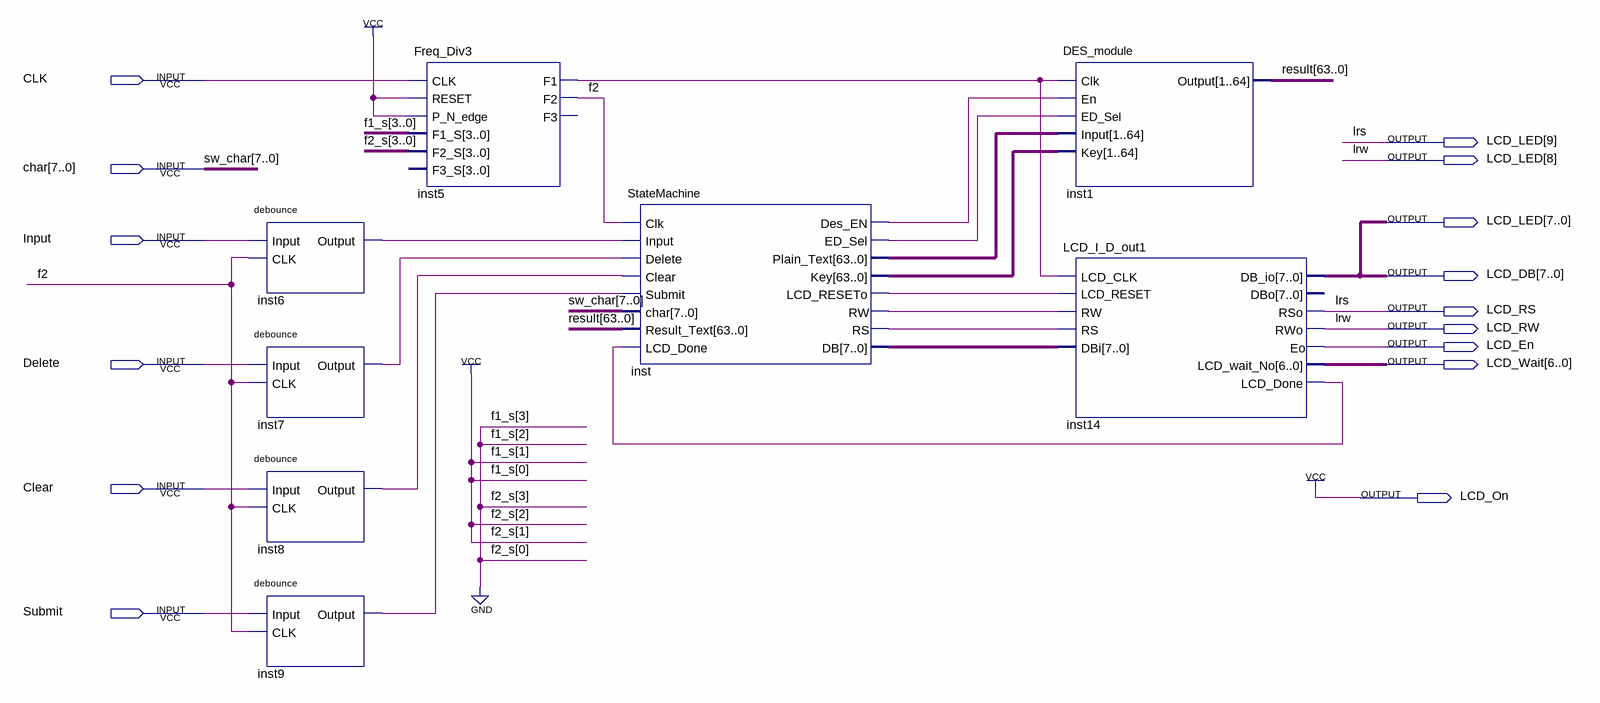
[diagram p0: schematic sheet]
// Quartus schematic Project.bdf as structural Verilog: 8 symbols, 15 pins
module Project (
  input  CLK,
  input  [7:0] char,
  input  Input,
  input  Delete,
  input  Clear,
  input  Submit,
  output [9:0] LCD_LED,
  output [7:0] LCD_DB,
  output LCD_RS,
  output LCD_RW,
  output LCD_En,
  output [6:0] LCD_Wait,
  output LCD_On
);

  wire f2, inst5_f1, inst6_output, inst7_output, inst8_output, inst9_output, inst14_lcd_done, inst_des_en,
       inst_ed_sel, inst_lcd_reseto, inst_rs, inst_rw;
  wire [7:0] inst_db;
  wire [63:0] inst_key, inst_plain_text, result;

  debounce inst6 (.Input(Input), .CLK(f2), .Output(inst6_output));
  debounce inst7 (.Input(Delete), .CLK(f2), .Output(inst7_output));
  debounce inst8 (.Input(Clear), .CLK(f2), .Output(inst8_output));
  debounce inst9 (.Input(Submit), .CLK(f2), .Output(inst9_output));
  Freq_Div3 inst5 (
    .CLK(CLK), .RESET(1'b1), .P_N_edge(1'b1), .F1_S(4'b0011), .F2_S(4'b0110), .F1(inst5_f1), .F2(f2));  // open: F3_S, F3
  StateMachine inst (
    .Clk(f2), .Input(inst6_output), .Delete(inst7_output), .Clear(inst8_output), .Submit(inst9_output),
    .char(char), .Result_Text(result), .LCD_Done(inst14_lcd_done), .Des_EN(inst_des_en),
    .ED_Sel(inst_ed_sel), .Plain_Text(inst_plain_text), .Key(inst_key), .LCD_RESETo(inst_lcd_reseto),
    .RW(inst_rw), .RS(inst_rs), .DB(inst_db));
  DES_module inst1 (
    .Clk(inst5_f1), .En(inst_des_en), .ED_Sel(inst_ed_sel), .Input(inst_plain_text), .Key(inst_key),
    .Output(result));
  LCD_I_D_out1 inst14 (
    .LCD_CLK(inst5_f1), .LCD_RESET(inst_lcd_reseto), .RW(inst_rw), .RS(inst_rs), .DBi(inst_db),
    .RSo(LCD_LED[9]), .RWo(LCD_LED[8]), .Eo(LCD_En), .LCD_wait_No(LCD_Wait), .LCD_Done(inst14_lcd_done),
    .DB_io(LCD_DB));  // open: DBo

  assign LCD_LED[7:0] = LCD_DB;
  assign LCD_On = 1'b1;
  assign LCD_RS = LCD_LED[9];
  assign LCD_RW = LCD_LED[8];

  // Other names for the same wires on the sheet: lrs = LCD_LED[9]; lrw = LCD_LED[8]; sw_char[7:0] = char
endmodule
